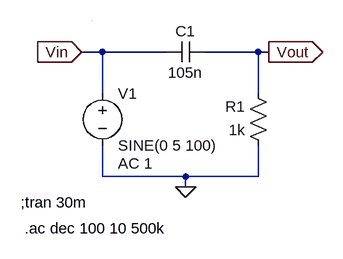
[diagram p0: schematic Draft11.asc]
Draft11.asc, the LTspice schematic file:
Version 4
SHEET 1 880 680
WIRE 16 48 -16 48
WIRE 112 48 16 48
WIRE 256 48 176 48
WIRE 272 48 256 48
WIRE 16 112 16 48
WIRE 256 112 256 48
WIRE 16 240 16 192
WIRE 144 240 16 240
WIRE 256 240 256 192
WIRE 256 240 144 240
WIRE 144 256 144 240
WIRE 0 0 0 0
FLAG 144 256 0
FLAG -16 48 Vin
IOPIN -16 48 In
FLAG 272 48 Vout
IOPIN 272 48 Out
SYMBOL cap 176 32 R90
WINDOW 0 0 32 VBottom 2
WINDOW 3 32 32 VTop 2
SYMATTR InstName C1
SYMATTR Value 105n
SYMBOL voltage 16 96 R0
WINDOW 123 24 124 Left 2
WINDOW 39 0 0 Left 0
SYMATTR InstName V1
SYMATTR Value SINE(0 5 100)
SYMATTR Value2 AC 1
SYMBOL res 272 208 R180
WINDOW 0 36 76 Left 2
WINDOW 3 36 40 Left 2
SYMATTR InstName R1
SYMATTR Value 1k
TEXT -110 280 Left 2 !;tran 30m
TEXT -104 320 Left 2 !.ac dec 100 10 500k

The netlist it stands for:
* Draft11.asc
C1 Vout Vin 105n
V1 Vin 0 SINE(0 5 100) AC 1
R1 0 Vout 1k
;tran 30m
.ac dec 100 10 500k
.backanno
.end

* Results of the author's LTspice run, read from the files saved beside the schematic
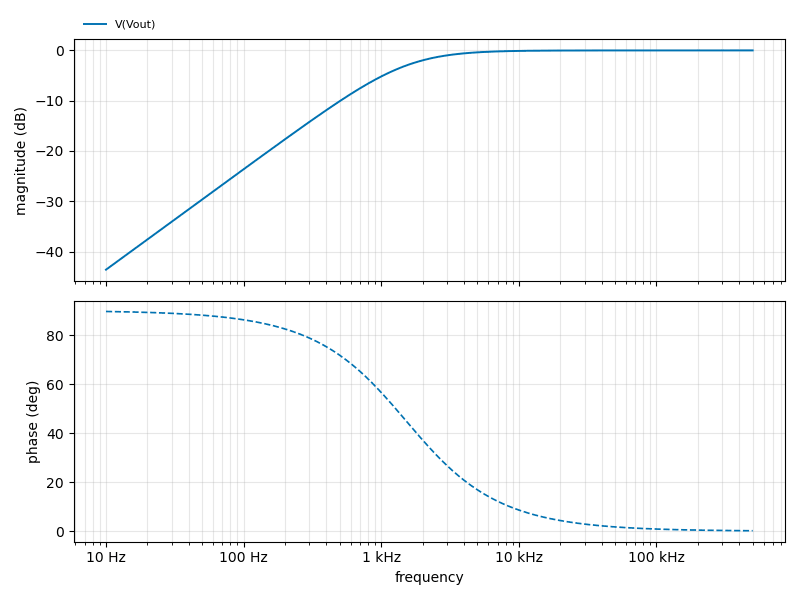
[diagram p1: AC Analysis of Draft11.asc, plotted from the saved traces]
* AC Analysis, 1 run:
*   V(Vout): -43.61 dB at 10 Hz, -0.00 dB at 500 kHz, peak -0.00 dB at 500 kHz, 3 dB below the peak at 1.516 kHz